# Altium schematic sheet connector.SchDoc: Connector
size A4; Author: Robocup; Organization: Hamburg Bit-Bots; Address1: Vogt-Kölln-Str. 30; Address2: 225257 Hamburg; Address3: Germany; Address4: www.bit-bots.de; DocumentNumber: 2; SheetNumber: 2; SheetTotal: 7; EMail: info@bit-bots.de
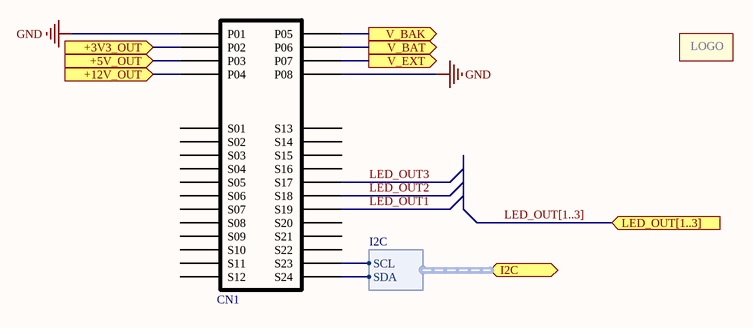
[diagram p0: connector.SchDoc]

## Parts
CN1  4-24-4-Connector  [ET60T-04-24-04-L-RT1-gp]  (value not drawn)
Logo1  Hamburg Bit-Bots Logo  [Logo]  (value not drawn)  (no BOM)

## Ports
+3V3_OUT (in), +5V_OUT (in), +12V_OUT (in), I2C (harness I2C), LED_OUT[1..3] (in), V_BAK (out), V_BAT (out), V_EXT (out)

## Harnesses
I2C: SCL, SDA

## Nets
GND: CN1.P01 CN1.P08
+3V3_OUT: CN1.P02 ; port +3V3_OUT
+5V_OUT: CN1.P03 ; port +5V_OUT
+12V_OUT: CN1.P04 ; port +12V_OUT
LED_OUT1: CN1.S19
LED_OUT2: CN1.S18
LED_OUT3: CN1.S17
V_BAK: CN1.P05 ; port V_BAK
V_BAT: CN1.P06 ; port V_BAT
V_EXT: CN1.P07 ; port V_EXT
NetCN1_S23: CN1.S23 ; port I2C.SCL
NetCN1_S24: CN1.S24 ; port I2C.SDA

Not connected (* = marked no-connect by the designer): CN1 S01 S02 S03 S04 S05 S06 S07 S08 S09 S10 S11 S12 S13 S14 S15 S16 S20 S21 S22

## Buses and harness runs
bus LED_OUT[1..3] = port LED_OUT[1..3]

## Notes on the sheet
- Project:
- Author:
- Title:
- Rev:
- Date:
- Time:
- Sheet
- of
- (in symbol Logo) LOGO

## Library data of the parts
CN1 = ET60T-04-24-04-L-RT1-GP: Samtec Connector
Logo1 = Logo